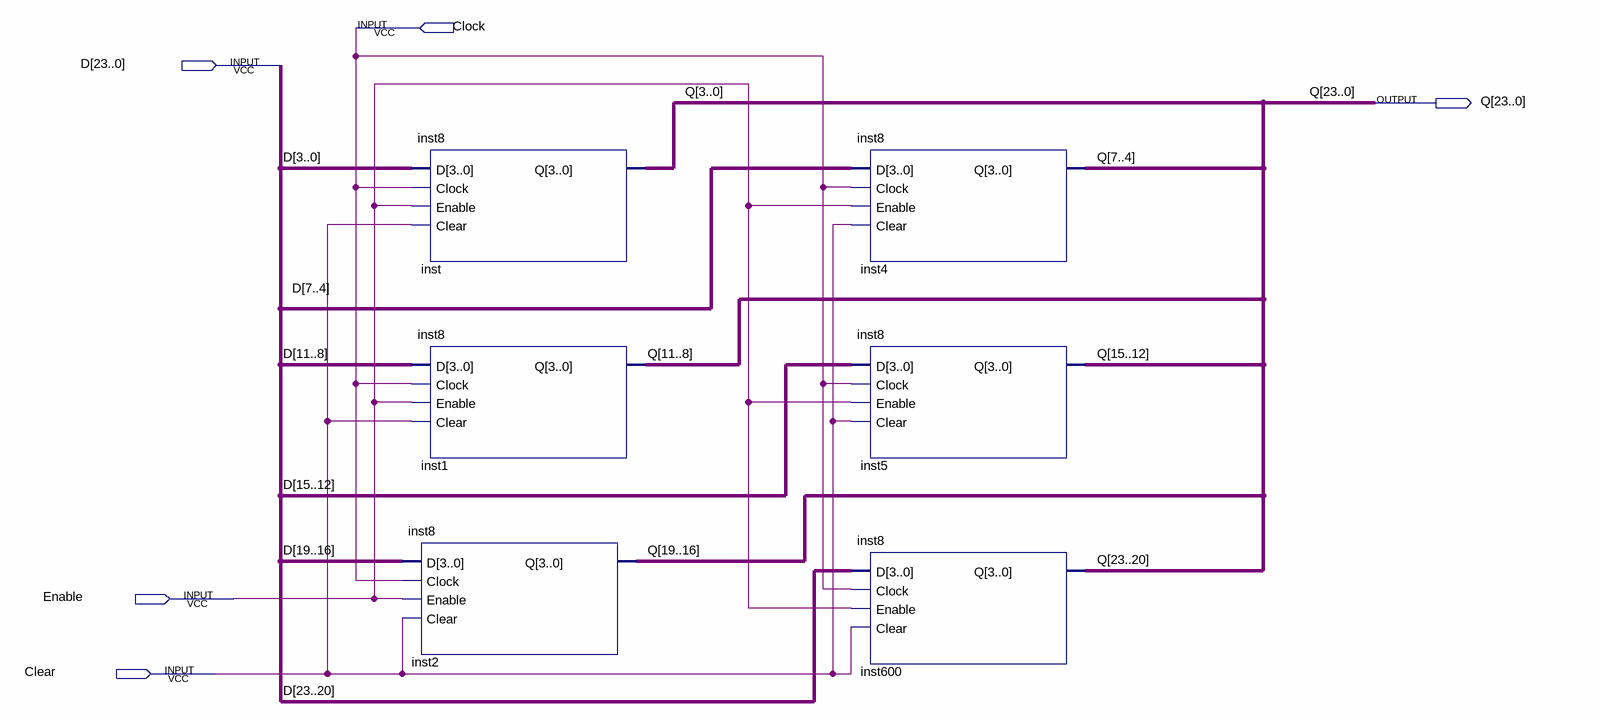
[diagram p0: schematic sheet]
// Quartus schematic inst.bdf as structural Verilog: 6 symbols, 5 pins
module inst (
  input  Clock,
  input  [23:0] D,
  input  Enable,
  input  Clear,
  output [23:0] Q
);

  inst8 inst (.D(D[3:0]), .Clock(Clock), .Enable(Enable), .Clear(Clear), .Q(Q[3:0]));
  inst8 inst1 (.D(D[11:8]), .Clock(Clock), .Enable(Enable), .Clear(Clear), .Q(Q[11:8]));
  inst8 inst2 (.D(D[19:16]), .Clock(Clock), .Enable(Enable), .Clear(Clear), .Q(Q[19:16]));
  inst8 inst4 (.D(D[7:4]), .Clock(Clock), .Enable(Enable), .Clear(Clear), .Q(Q[7:4]));
  inst8 inst5 (.D(D[15:12]), .Clock(Clock), .Enable(Enable), .Clear(Clear), .Q(Q[15:12]));
  inst8 inst600 (.D(D[23:20]), .Clock(Clock), .Enable(Enable), .Clear(Clear), .Q(Q[23:20]));
endmodule
